# EAGLE design esp01 (EAGLE 8.4.2)

## Sheet 1 of 3
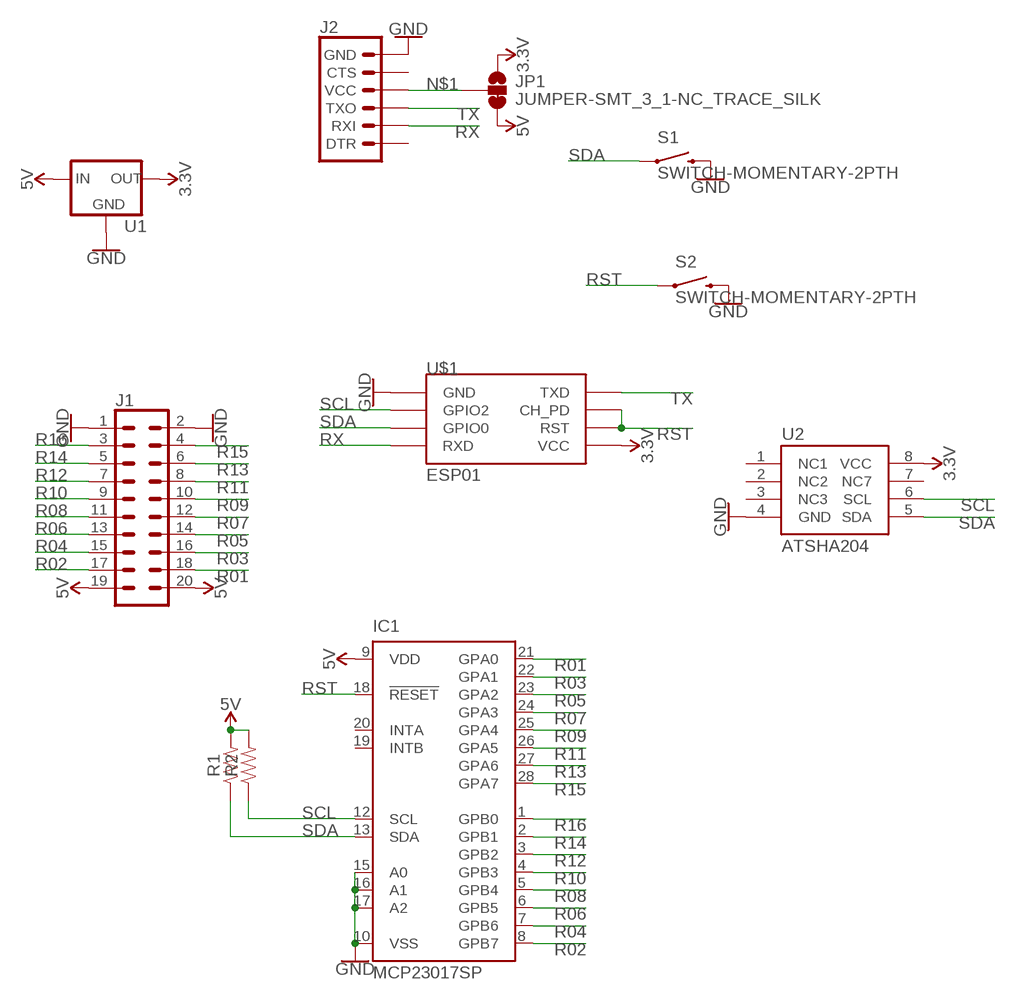
[diagram p0: schematic, sheet 1]

### Parts
IC1  MCP23017SP  [DIL28-3]
J1  CONN_10X2  [2X10]
J2  6_PIN_SERIAL_TARGETLONGPADS  [1X06_LONGPADS]
JP1  JUMPER-SMT_3_1-NC_TRACE_SILK  [SMT-JUMPER_3_1-NC_TRACE_SILK]
R1  RESISTORAXIAL-0.3  [AXIAL-0.3]
R2  RESISTORAXIAL-0.3  [AXIAL-0.3]
S1  SWITCH-MOMENTARY-2PTH  [TACTILE-PTH]
S2  SWITCH-MOMENTARY-2PTH  [TACTILE-PTH]
U1  V_REG_78XXSIDE  [78XXL]
U2  ATSHA204  ATSHA204_SOIC8  [SO08]
U$1  ESP01  [ESP01]

### Nets
3.3V: JP1.1 U1.OUT U2.8(VCC) U$1.VCC
5V: IC1.9(VDD) J1.19 J1.20 JP1.3 R1.P$2 R2.P$2 U1.IN
GND: IC1.10(VSS) IC1.15(A0) IC1.16(A1) IC1.17(A2) J1.1 J1.2 J2.6(GND) S1.3 S1.4 S2.3 S2.4 U1.GND U2.4(GND) U$1.GND
N$1: J2.4(VCC) JP1.2
R01: IC1.21(GPA0) J1.18
R02: IC1.8(GPB7) J1.17
R03: IC1.22(GPA1) J1.16
R04: IC1.7(GPB6) J1.15
R05: IC1.23(GPA2) J1.14
R06: IC1.6(GPB5) J1.13
R07: IC1.24(GPA3) J1.12
R08: IC1.5(GPB4) J1.11
R09: IC1.25(GPA4) J1.10
R10: IC1.4(GPB3) J1.9
R11: IC1.26(GPA5) J1.8
R12: IC1.3(GPB2) J1.7
R13: IC1.27(GPA6) J1.6
R14: IC1.2(GPB1) J1.5
R15: IC1.28(GPA7) J1.4
R16: IC1.1(GPB0) J1.3
RST: IC1.18(!RESET) S2.1 S2.2 U$1.CH_PD U$1.RST
RX: J2.2(RXI) U$1.RX(RXD)
SCL: IC1.12(SCL) R2.P$1 U2.6(SCL) U$1.GPIO2
SDA: IC1.13(SDA) R1.P$1 S1.1 S1.2 U2.5(SDA) U$1.GPIO0
TX: J2.3(TXO) U$1.TX(TXD)
Unconnected: IC1.19(INTB) IC1.20(INTA) J2.1(DTR) J2.5(CTS) U2.1(NC1) U2.2(NC2) U2.3(NC3) U2.7(NC7)

## Sheet 2 of 3

## Sheet 3 of 3

## Library data of the parts
IC1 = adafruit:MCP23017: http://ww1.microchip.com/downloads/en/DeviceDoc/21952a.pdf Source: http://ww1.microchip.com/downloads/en/DeviceDoc/21952a.pdf
J1 = SparkFun-Connectors:CONN_10X2: Multi connection point. Often used as Generic Header-pin footprint for 0.1 inch spaced/style header connections On any of the 0.1 inch spaced packages, you can populate with these: Break Away Headers - Straight <https://www.sparkfun.com/products/116> (PRT-00116) Break Away Male Headers - Right Angle <https://www.sparkfun.com/products/553> (PRT-00553) Female Headers <https://www.sparkfun.com/products/115> (PRT-00115) Break Away Headers - Machine Pin <https://www.sparkfun.com/products/117> (PRT-00117) Break Away Female Headers - Swiss Machine Pin <https://www.sparkfun.com/products/743> (PRT-00743) Special note about the "SPECIAL" package: This was SPECIALLY designed to be used with our Graphic LCD Backpack. Be sure you want to use this! It is not only staggered on each line of header holes, but IT IS ALSO offset of the center point of the top and bottom lines by 5 mil. This causes the headers to lock into place on the "standard" footprint on the LCD screen. The extra squares on the tdocu layer are there simply to reference other pins (if you were to actually populate a longer header than ten long - this is what we do with the backpacks).
J2 = SparkFun-Connectors:6_PIN_SERIAL_TARGET: 6-pin header connection for use with the "FTDI BASIC" pinout - TARGET SIDE. Also known as "Arduino Serial Program Header". It is used to mate with our FTDI Basic serial programmers using the Arduino IDE. Note, this device has "TARGET" in the name. It is intended to be used on a design that contains a target micro-controller that you wish to program. The "sister" device, named "CABLE" is inteneded to be used on a design that usually lives on the end of your USB cable and prvides the converter chip (FTDI232 or FTDI231x) to commnicate serial RX/TX. You can populate with some of these: Break Away Headers - Straight <https://www.sparkfun.com/products/116> (PRT-00116) For reference (or to suit your programming needs) check out these designs: SparkFun FTDI Basic Breakout - 5V <https://www.sparkfun.com/products/9716> (DEV-09716) SparkFun FTDI Basic Breakout - 3.3V <https://www.sparkfun.com/products/9873> (DEV-09873) SparkFun FTDI SmartBasic <https://www.sparkfun.com/products/12935> (DEV-12935) SparkFun Beefy 3 - FTDI Basic Breakout <https://www.sparkfun.com/products/13746> (DEV-13746)
JP1 = SparkFun-Jumpers:JUMPER-SMT_3_1-NC_TRACE: Normally closed trace jumper (1 of 2 connections) This jumper has a trace between two pads so it's normally closed (NC). The other connection is normally open (NO). Use a razor knife to open the connection. For best results follow the IPC guidelines for cutting traces: Cutout at least 0.063 mm (0.005 in). Remove all loose material to clean up the cut area. Seal the cut with an approved epoxy. Reapply solder to reclose the connection, or to close the NO connection.
R1 R2 = SparkFun-Resistors:RESISTOR: Generic Resistor Package
S1 S2 = maxorig:SWITCH-MOMENTARY-2: Various NO switches- pushbuttons, reed, etc; PROD_ID: SWCH-08441
U1 = SparkFun-IC-Power:V_REG_78XX: Voltage Regulator Standard 78xx regulator. IGO (Input Ground Output). Spark Fun Electronics SKU : COM-00107
U2 = SparkFun-IC-Special-Function:ATSHA204_SOIC8: Crypto 4.5KB I2C Datasheet <https://cdn.sparkfun.com/datasheets/Dev/Beagle/Atmel-8740-CryptoAuth-ATSHA204-Datasheet.pdf> SparkFun Products CryptoCape <https://www.sparkfun.com/products/12773> (DEV-12773) SparkFun CryptoShield <https://www.sparkfun.com/products/13183> (DEV-13183); PROD_ID: IC-11981
U$1 = esp8266modules:ESP01: ESP8266 Wifi module 01

## Board
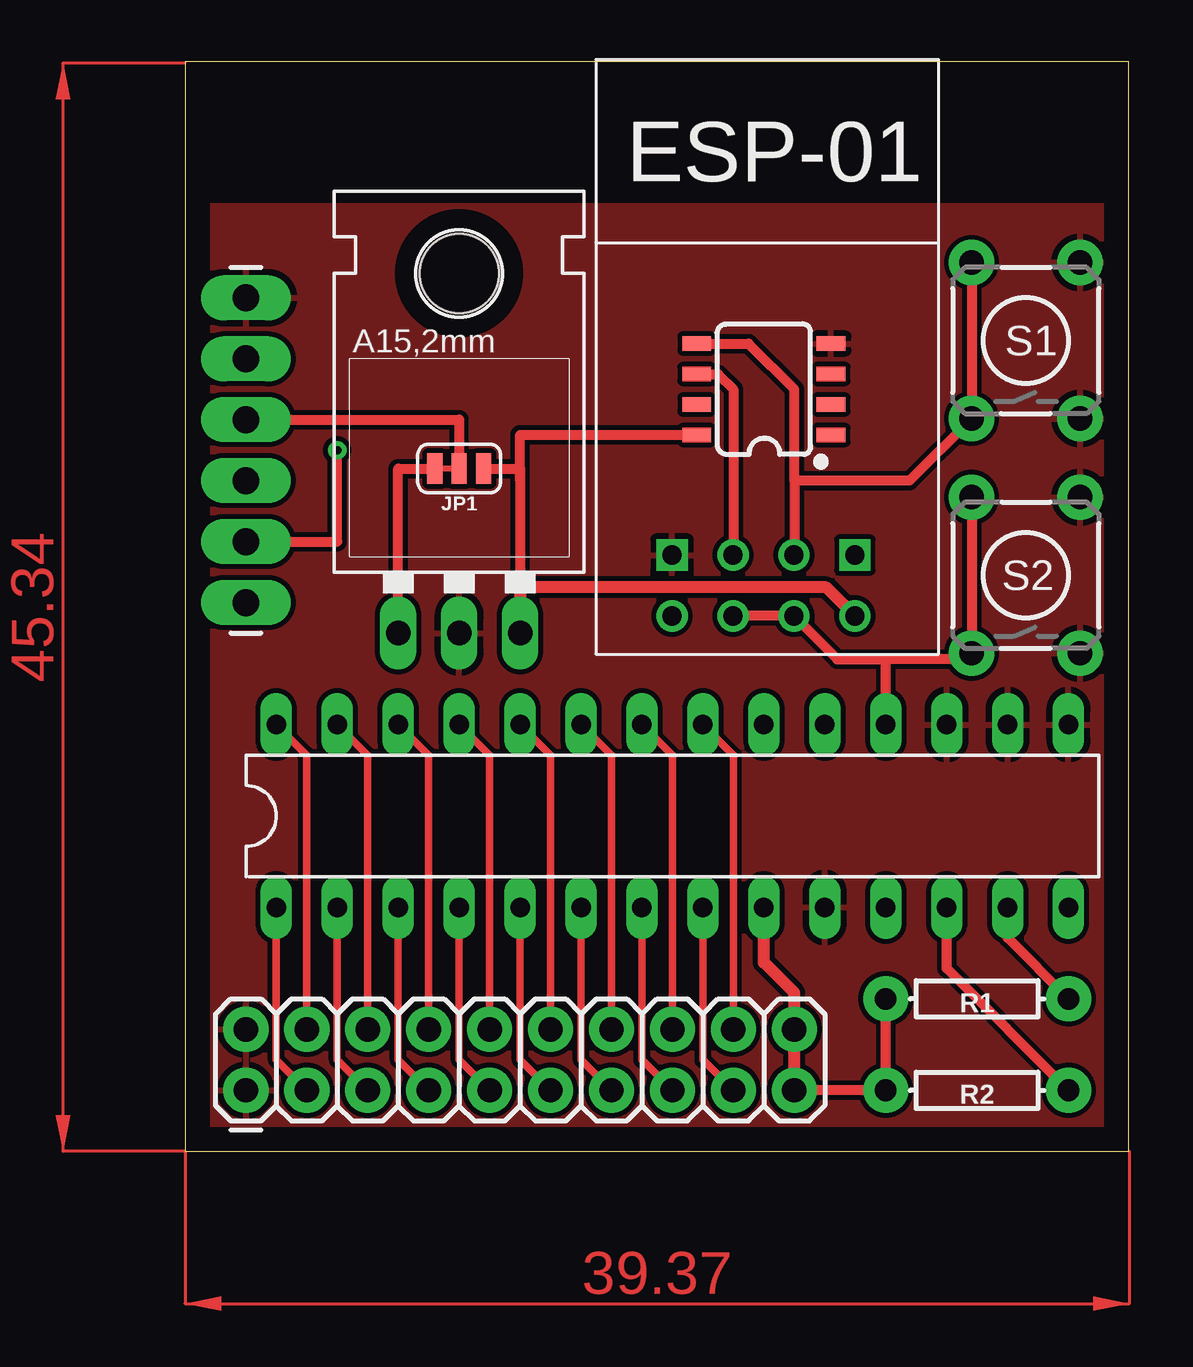
[diagram p1: board, top side]
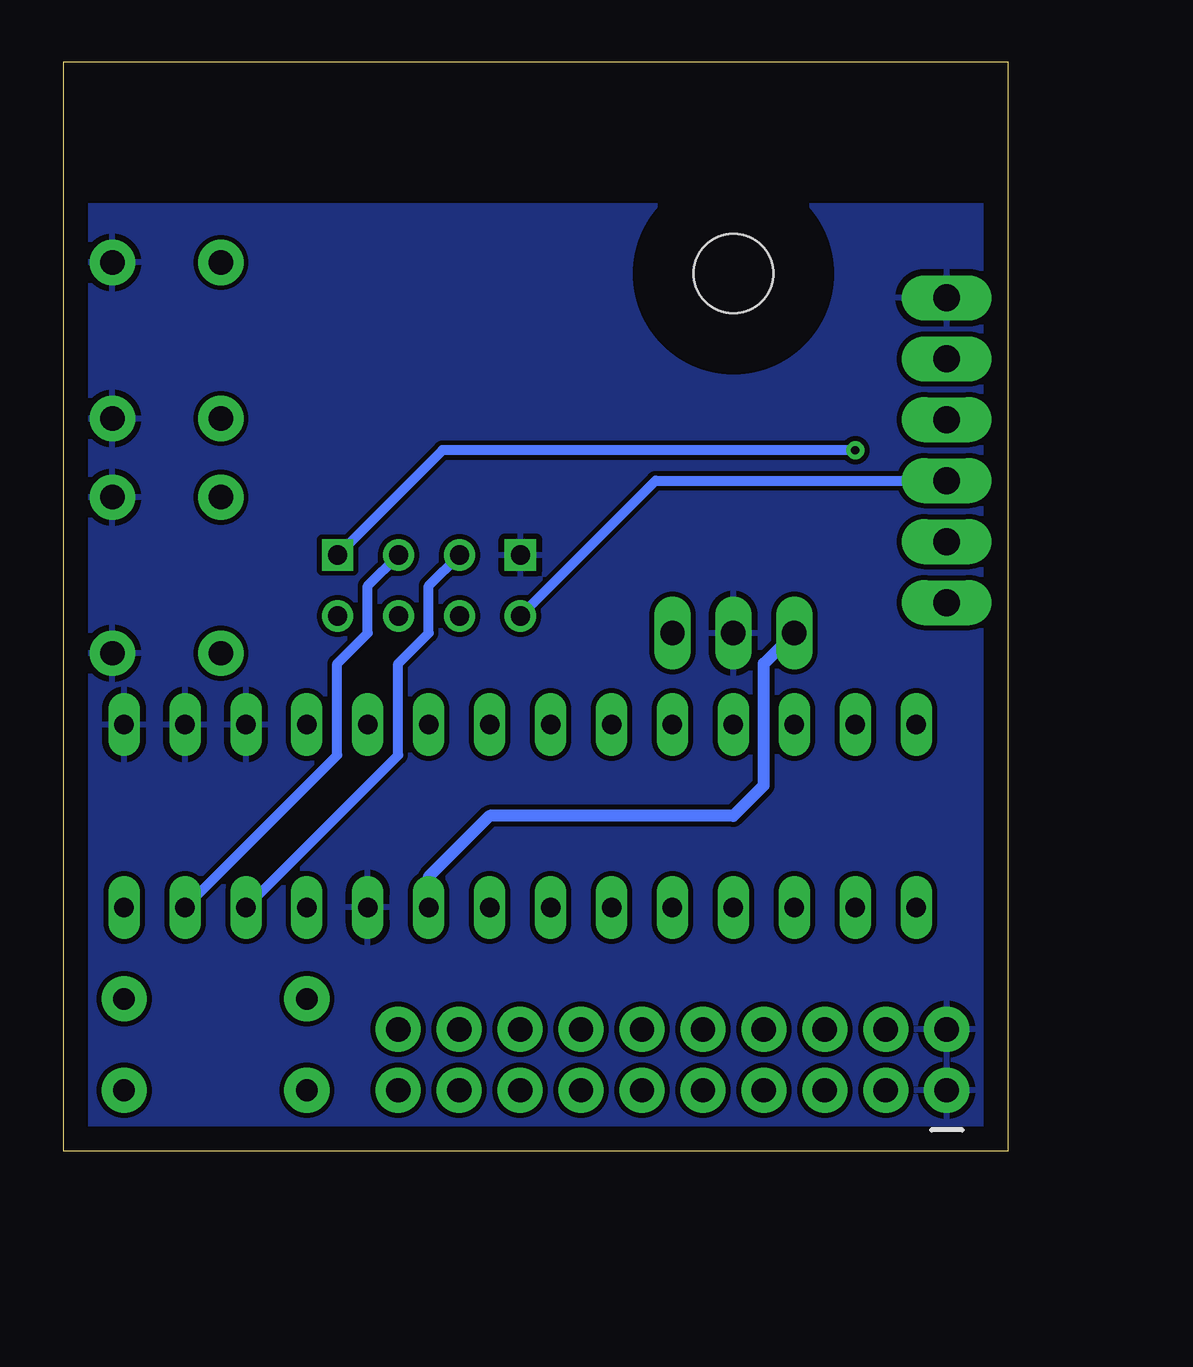
[diagram p2: board, bottom side, seen from below]

Size 39.35 x 45.39 mm. Coordinates in mm from the lower left corner, seen from the top.
Outline: 0,0 39.35,0 39.35,45.39 0,45.39 0,0
Copper layers (1*16): Top 0.035mm / dielectric 1.5mm / Bottom 0.035mm
Design rules "default": minimum track width 10mil, minimum drill 24mil, track to track 8mil, track to pad 8mil, pad to pad 8mil, via to via 8mil, smd to smd 8mil, copper to edge 40mil, drill to drill 8mil, minimum pad ring 10mil, minimum via ring 8mil, stop-mask expansion 4mil, vias tented up to drill 0mil, thermal gap 10mil

### Footprints (pad centres in the part's own frame; a part is rotated, then mirrored left to right if it is on the bottom)
DIL28-3 = drill 0.813 long: 1 -16.51,-3.81; 2 -13.97,-3.81; 3 -11.43,-3.81; 4 -8.89,-3.81; 5 -6.35,-3.81; 6 -3.81,-3.81; 7 -1.27,-3.81; 8 1.27,-3.81; 9 3.81,-3.81; 10 6.35,-3.81; 11 8.89,-3.81; 12 11.43,-3.81; 13 13.97,-3.81; 14 16.51,-3.81; 15 16.51,3.81; 16 13.97,3.81; 17 11.43,3.81; 18 8.89,3.81; 19 6.35,3.81; 20 3.81,3.81; 21 1.27,3.81; 22 -1.27,3.81; 23 -3.81,3.81; 24 -6.35,3.81; 25 -8.89,3.81; 26 -11.43,3.81; 27 -13.97,3.81; 28 -16.51,3.81
2X10 = drill 1.016 pad 1.88: 1 0,0; 2 0,2.54; 3 2.54,0; 4 2.54,2.54; 5 5.08,0; 6 5.08,2.54; 7 7.62,0; 8 7.62,2.54; 9 10.16,0; 10 10.16,2.54; 11 12.7,0; 12 12.7,2.54; 13 15.24,0; 14 15.24,2.54; 15 17.78,0; 16 17.78,2.54; 17 20.32,0; 18 20.32,2.54; 19 22.86,0; 20 22.86,2.54
1X06_LONGPADS = drill 1.118 pad 1.88 long: 1 0,0; 2 2.54,0; 3 5.08,0; 4 7.62,0; 5 10.16,0; 6 12.7,0
SMT-JUMPER_3_1-NC_TRACE_SILK = smd 0.635 x 1.27: 1 -1.016,0; 2 0,0; 3 1.016,0
AXIAL-0.3 = drill 0.9 pad 1.88: P$1 -3.81,0; P$2 3.81,0
TACTILE-PTH = drill 1.016 pad 1.88: 1 -3.251,2.261; 2 3.251,2.261; 3 -3.251,-2.261; 4 3.251,-2.261
78XXL = drill 1.016 long: GND 0,-3.81; IN -2.54,-3.81; OUT 2.54,-3.81 | hole 3.302: 0,11.176
SO08 = smd 0.6 x 1.2: 1 -1.905,-2.8; 2 -0.635,-2.8; 3 0.635,-2.8; 4 1.905,-2.8; 5 1.905,2.8; 6 0.635,2.8; 7 -0.635,2.8; 8 -1.905,2.8
ESP01 = drill 0.8: CH_PD -1.285,-8.178; GPIO0 1.255,-5.638; GPIO2 -1.285,-5.638; RST 1.255,-8.178; TX -3.825,-8.178; VCC 3.795,-8.178 | drill 0.8 square: GND -3.825,-5.638; RX 3.795,-5.638

### Placement (x,y rotation side)
IC1  20.32,13.97 0 top
J1  2.54,2.54 0 top
J2  2.54,22.86 90 top
JP1  11.43,28.45 180 top
R1  33.02,6.35 180 top
R2  33.02,2.54 180 top
S1  35.05,33.78 90 top
S2  35.05,24 90 top
U1  11.43,25.4 0 top
U2  24.13,31.75 90 top
U$1  24.13,30.48 0 top

### Tracks (layer width: path | path; a pad name or v marks a point on that pad's centre or on a via)
3.3V
  Top 0.406: U2.8 13.97,29.84 13.97,27.94 | 13.97,27.94 U1.OUT | JP1.1 13.97,28.45 13.97,27.94
  Top 0.508: U$1.VCC 26.73,23.5 13.97,23.5 U1.OUT
5V
  Top 0.406: J1.19 R2.P$2 R1.P$2 | U1.IN 8.89,28.45 JP1.3
  Top 0.508: J1.19 J1.20 25.4,6.6 24.13,7.87 IC1.9
  Bottom 0.508: U1.IN 10.16,20.32 10.16,15.24 11.43,13.97 21.59,13.97 24.13,11.43 IC1.9
GND
  pour Bottom: 39.37,39.37 39.37,0 0,0 0,39.37
  pour Top: 0,39.37 0,0 39.37,0 39.37,39.37
N$1
  Top 0.406: J2.4 11.43,30.48 JP1.2
R01
  Top 0.305: J1.18 22.86,16.51 IC1.21
R02
  Top 0.305: J1.17 21.59,3.81 IC1.8
R03
  Top 0.305: J1.16 20.32,16.51 IC1.22
R04
  Top 0.305: J1.15 19.05,3.81 IC1.7
R05
  Top 0.305: J1.14 17.78,16.51 IC1.23
R06
  Top 0.305: J1.13 16.51,3.81 IC1.6
R07
  Top 0.305: J1.12 15.24,16.51 IC1.24
R08
  Top 0.305: J1.11 13.97,3.81 IC1.5
R09
  Top 0.305: J1.10 12.7,16.51 IC1.25
R10
  Top 0.305: J1.9 11.43,3.81 IC1.4
R11
  Top 0.305: J1.8 10.16,16.51 IC1.26
R12
  Top 0.305: J1.7 8.89,3.81 IC1.3
R13
  Top 0.305: J1.6 7.62,16.51 IC1.27
R14
  Top 0.305: J1.5 6.35,3.81 IC1.2
R15
  Top 0.305: J1.4 5.08,16.51 IC1.28
R16
  Top 0.305: J1.3 3.81,3.81 IC1.1
RST
  Top 0.406: U$1.CH_PD U$1.RST 27.19,20.5 29.21,20.5 | S2.2 S2.1 32.79,20.62 32.66,20.5 29.21,20.5 | IC1.18 29.21,20.5
RX  (via drill 0.35)
  Top 0.406: J2.2 6.35,25.4 v6.35,29.21
  Bottom 0.406: v6.35,29.21 23.56,29.21 U$1.RX
SCL
  Top 0.406: R2.P$1 31.75,7.62 IC1.12 | U2.6 22.23,32.38 22.86,31.75 22.86,24.86 U$1.GPIO2
  Bottom 0.406: IC1.12 25.4,16.51 25.4,20.32 24.13,21.59 24.13,23.56 U$1.GPIO2
SDA
  Top 0.406: R1.P$1 34.29,8.89 IC1.13 | S1.2 S1.1 30.2,27.94 25.4,27.94 | U2.5 23.5,33.66 25.4,31.75 25.4,27.94 | 25.4,27.94 25.4,24.86 U$1.GPIO0
  Bottom 0.406: IC1.13 27.94,16.51 27.94,20.32 26.67,21.59 26.67,23.56 U$1.GPIO0
TX
  Bottom 0.406: U$1.TX 14.67,27.94 J2.3
(copper drawn outside any net)
  shapes: Top area x2